# Altium project dji_3s_battery.PrjPcb
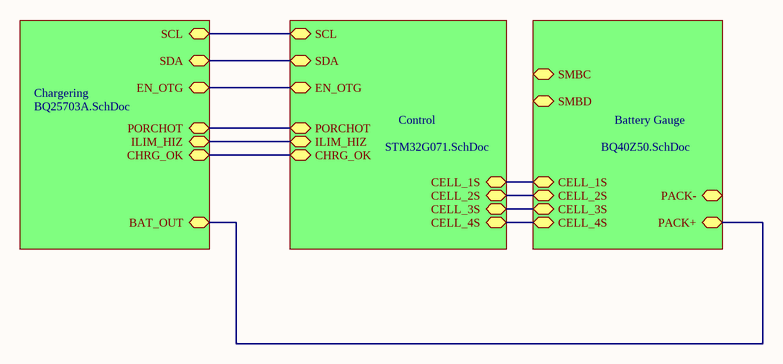
[diagram p0: Smart_Battery_main.SchDoc]
4 sheets, 147 parts. Net scope: global (net labels, ports and power ports of the same name join across sheets).
Board file: dji_3s_battery_PCB.PcbDoc
Sheets:
  Smart_Battery_main.SchDoc
    Battery Gauge = BQ40Z50.SchDoc
    Chargering = BQ25703A.SchDoc
    Control = STM32G071.SchDoc

## Sheet Smart_Battery_main.SchDoc: Smart_Battery
size A4; Author: Dj140; DrawnBy: Dj140

### Sub-sheets
Battery Gauge = BQ40Z50.SchDoc: PACK+, CELL_4S, CELL_3S, CELL_2S, CELL_1S, PACK-, SMBC, SMBD
Chargering = BQ25703A.SchDoc: SCL, SDA, EN_OTG, ILIM_HIZ, BAT_OUT, CHRG_OK, PORCHOT
Control = STM32G071.SchDoc: SCL, SDA, EN_OTG, ILIM_HIZ, PORCHOT, CHRG_OK, CELL_1S, CELL_2S, CELL_3S, CELL_4S

### Nets
(unnamed): sheet Battery Gauge/PACK+, sheet Chargering/BAT_OUT
(unnamed): sheet Battery Gauge/CELL_4S, sheet Control/CELL_4S
(unnamed): sheet Battery Gauge/CELL_3S, sheet Control/CELL_3S
(unnamed): sheet Battery Gauge/CELL_2S, sheet Control/CELL_2S
(unnamed): sheet Battery Gauge/CELL_1S, sheet Control/CELL_1S
(unnamed): sheet Chargering/SCL, sheet Control/SCL
(unnamed): sheet Chargering/SDA, sheet Control/SDA
(unnamed): sheet Chargering/EN_OTG, sheet Control/EN_OTG
(unnamed): sheet Chargering/ILIM_HIZ, sheet Control/ILIM_HIZ
(unnamed): sheet Chargering/CHRG_OK, sheet Control/CHRG_OK
(unnamed): sheet Chargering/PORCHOT, sheet Control/PORCHOT

## Sheet BQ40Z50.SchDoc
size A2
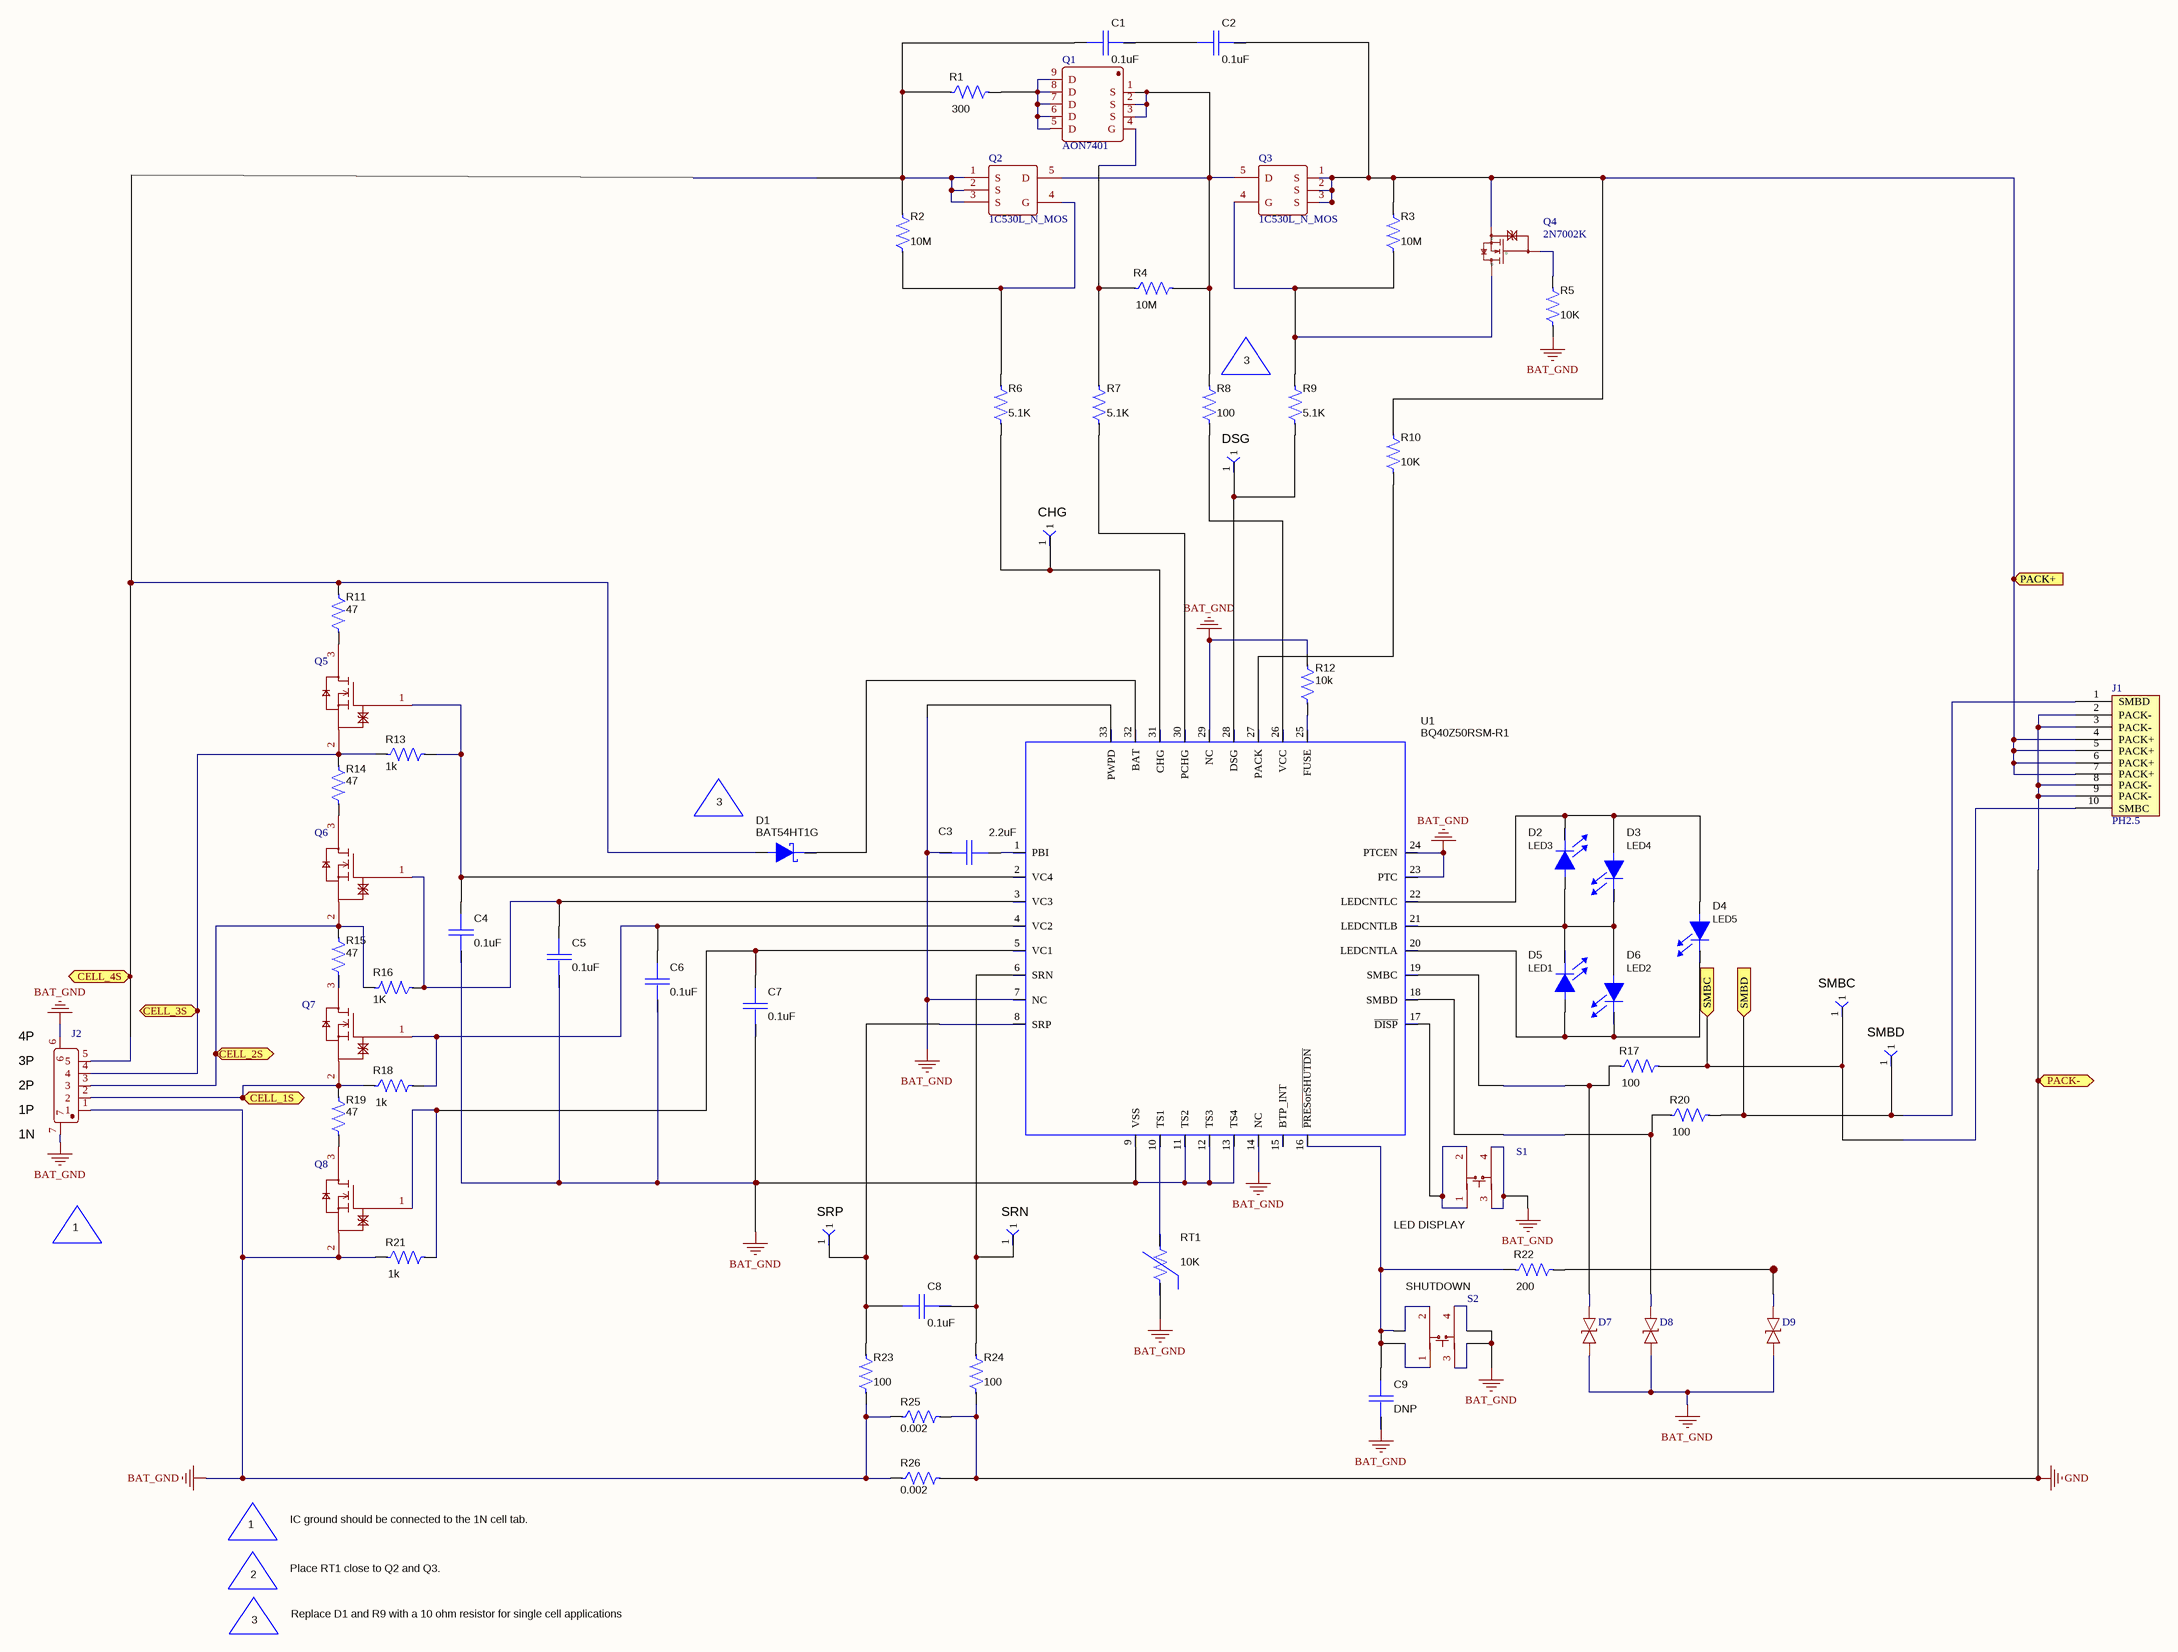
[diagram p1: BQ40Z50.SchDoc]

### Parts
C1  value 0.1uF  [C603]  (hidden comment: C0603C104M5RACTU)
C2  value 0.1uF  [C603]  (hidden comment: C0603C104M5RACTU)
C3  value 2.2uF  [C0805]  (hidden comment: C2012X7R1E225M085AB)
C4  value 0.1uF  [C603]  (hidden comment: C0603C104M5RACTU)
C5  value 0.1uF  [C603]  (hidden comment: C0603C104M5RACTU)
C6  value 0.1uF  [C603]  (hidden comment: C0603C104M5RACTU)
C7  value 0.1uF  [C603]  (hidden comment: C0603C104M5RACTU)
C8  value 0.1uF  [C603]  (hidden comment: C0603C104M5RACTU)
C9  value DNP  [C603]  (hidden comment: C0603C104M5RACTU)
D1  value BAT54HT1G  [SOD-323]  (hidden comment: D-BAT54HT1)
D2  D_LED_SML-LXR1206USBC-TR  [LED0805]  (value not drawn)
D3  D_LED_SML-LXR1206USBC-TR  [LED0805]  (value not drawn)
D4  D_LED_SML-LXR1206USBC-TR  [LED0805]  (value not drawn)
D5  D_LED_SML-LXR1206USBC-TR  [LED0805]  (value not drawn)
D6  D_LED_SML-LXR1206USBC-TR  [LED0805]  (value not drawn)
D7  ESD_Diode  [ESD_Diode]  (value not drawn)
D8  ESD_Diode  [ESD_Diode]  (value not drawn)
D9  ESD_Diode  [ESD_Diode]  (value not drawn)
J1  PH2.5  [PH2.5]
J2  SMD_1.25  [SMD_1.25]  (value not drawn)
Q1  AON7401  [DFN-8]
Q2  1C530L_N_MOS  [LFPAK]
Q3  1C530L_N_MOS  [LFPAK]
Q4  2N7002K  [2N7002K]
Q5  DMN601K  [SOT-23 - duplicate]  (value not drawn)
Q6  DMN601K  [SOT-23 - duplicate]  (value not drawn)
Q7  DMN601K  [SOT-23 - duplicate]  (value not drawn)
Q8  DMN601K  [SOT-23 - duplicate]  (value not drawn)
R1  value 300  [R2512]  (hidden comment: CRCW2512300RJNEG)
R2  value 10M  [0603]  (hidden comment: CRCW060310M0JNEA)
R3  value 10M  [0603]  (hidden comment: CRCW060310M0JNEA)
R4  value 10M  [0603]  (hidden comment: CRCW060310M0JNEA)
R5  value 10K  [0603]  (hidden comment: CRCW060310M0JNEA)
R6  value 5.1K  [0603]  (hidden comment: CRCW06035K10JNEA)
R7  value 5.1K  [0603]  (hidden comment: CRCW06035K10JNEA)
R8  value 100  [0603]  (hidden comment: CRCW0603100RJNEAHP)
R9  value 5.1K  [0603]  (hidden comment: CRCW06035K10JNEA)
R10  value 10K  [0603]  (hidden comment: CRCW060310K0JNEA)
R11  value 47  [R1206]  (hidden comment: CSR1206-0R001F1)
R12  value 10k  [0603]  (hidden comment: CRCW06035K10JNEA)
R13  value 1k  [0603]  (hidden comment: CRCW0603100RJNEAHP)
R14  value 47  [R1206]  (hidden comment: CSR1206-0R001F1)
R15  value 47  [R1206]  (hidden comment: CSR1206-0R001F1)
R16  value 1K  [0603]  (hidden comment: CRCW0603100RJNEAHP)
R17  value 100  [0603]  (hidden comment: CRCW0603100RJNEAHP)
R18  value 1k  [0603]  (hidden comment: CRCW0603100RJNEAHP)
R19  value 47  [R1206]  (hidden comment: CSR1206-0R001F1)
R20  value 100  [0603]  (hidden comment: CRCW0603100RJNEAHP)
R21  value 1k  [0603]  (hidden comment: CRCW0603100RJNEAHP)
R22  value 200  [0603]  (hidden comment: CRCW0603200RJNEA)
R23  value 100  [0603]  (hidden comment: CRCW0603100RJNEAHP)
R24  value 100  [0603]  (hidden comment: CRCW0603100RJNEAHP)
R25  value 0.002  [R2512]  (hidden comment: CRCW2512300RJNEG)
R26  value 0.002  [R2512]  (hidden comment: CRCW2512300RJNEG)
RT1  value 10K  [C0805]  (hidden comment: 103AT-2)
S1  SW_SMD  [SW_SMD]  (value not drawn)
S2  SW_SMD  [SW_SMD]  (value not drawn)
TP1  TP_.040_SMT  [TP_.040_SMT]  (value not drawn)  (no BOM)
TP2  TP_.040_SMT  [TP_.040_SMT]  (value not drawn)  (no BOM)
TP3  TP_.040_SMT  [TP_.040_SMT]  (value not drawn)  (no BOM)
TP4  TP_.040_SMT  [TP_.040_SMT]  (value not drawn)  (no BOM)
TP5  TP_40_SMT  [TP_40_SMT]  (value not drawn)  (no BOM)
TP6  TP_.040_SMT  [TP_.040_SMT]  (value not drawn)  (no BOM)
U1  value BQ40Z50RSM-R1  [QFP-32P_(RSM)]  (hidden comment: BQ40Z55RSM)

### Ports
CELL_1S, CELL_2S, CELL_3S, CELL_4S, PACK+, PACK-, SMBC, SMBD

### Nets
BAT_GND: C3.1 C4.1 C5.1 C6.1 C7.1 C9.1 D7.1 D8.1 D9.1 J2.1 J2.6 J2.7 Q8.2(S) R5.1 R12.2 R21.1 R23.1 R25.1 R26.1 RT1.1 S1.3 S1.4 S2.3 S2.4 U1.7(NC) U1.9(VSS) U1.11(TS2) U1.12(TS3) U1.13(TS4) U1.14(NC) U1.23(PTC) U1.24(PTCEN) U1.29(NC) U1.33(PWPD)
GND: J1.2(PACK-) J1.3(PACK-) J1.8(PACK-) J1.9(PACK-) R24.1 R25.2 R26.2 ; port PACK-
NetC1_1: C1.1 C2.2
NetC1_2: C1.2 D1.2(A) J2.5 Q2.1(S) Q2.2(S) Q2.3(S) R1.1 R2.2 R11.1 ; port CELL_4S
NetC2_1: C2.1 J1.4(PACK+) J1.5(PACK+) J1.6(PACK+) J1.7(PACK+) Q3.1(S) Q3.2(S) Q3.3(S) Q4.2(S) R3.2 R10.2 ; port PACK+
NetC3_2: C3.2 U1.1(PBI)
NetC4_2: C4.2 Q5.1(G) R13.2 U1.2(VC4)
NetC5_2: C5.2 Q6.1(G) R16.1 U1.3(VC3)
NetC6_2: C6.2 Q7.1(G) R18.2 U1.4(VC2)
NetC7_2: C7.2 Q8.1(G) R21.2 U1.5(VC1)
NetC8_1: C8.1 R24.2 TP6.1 U1.6(SRN)
NetC8_2: C8.2 R23.2 TP5.1 U1.8(SRP)
NetC9_2: C9.2 R22.1 S2.1 S2.2 U1.16(~{PRESorSHUTDN})
NetD1_1: D1.1(C) U1.32(BAT)
NetD2_1: D2.1(C) D3.2(A) D4.2(A) U1.22(LEDCNTLC)
NetD2_2: D2.2(A) D3.1(C) D5.1(C) D6.2(A) U1.21(LEDCNTLB)
NetD4_1: D4.1(C) D5.2(A) D6.1(C) U1.20(LEDCNTLA)
NetD7_2: D7.2 R17.1 U1.19(SMBC)
NetD8_2: D8.2 R20.1 U1.18(SMBD)
NetD9_2: D9.2 R22.2
NetJ1_1: J1.1(SMBD) R20.2 TP4.1 ; port SMBD
NetJ1_10: J1.10(SMBC) R17.2 TP3.1 ; port SMBC
NetJ2_2: J2.2 Q7.2(S) R18.1 R19.2 ; port CELL_1S
NetJ2_3: J2.3 Q6.2(S) R15.2 R16.2 ; port CELL_2S
NetJ2_4: J2.4 Q5.2(S) R13.1 R14.1 ; port CELL_3S
NetQ1_1: Q1.1(S) Q1.2(S) Q1.3(S) Q2.5(D) Q3.5(D) R4.2 R8.2
NetQ1_4: Q1.4(G) R4.1 R7.2
NetQ1_5: Q1.5(D) Q1.6(D) Q1.7(D) Q1.8(D) Q1.9(D) R1.2
NetQ2_4: Q2.4(G) R2.1 R6.2
NetQ3_4: Q3.4(G) Q4.3(D) R3.1 R9.2
NetQ4_1: Q4.1(G) R5.2
NetQ5_3: Q5.3(D) R11.2
NetQ6_3: Q6.3(D) R14.2
NetQ7_3: Q7.3(D) R15.1
NetQ8_3: Q8.3(D) R19.1
NetR6_1: R6.1 TP2.1 U1.31(CHG)
NetR7_1: R7.1 U1.30(PCHG)
NetR8_1: R8.1 U1.26(VCC)
NetR9_1: R9.1 TP1.1 U1.28(DSG)
NetR10_1: R10.1 U1.27(PACK)
NetR12_1: R12.1 U1.25(FUSE)
NetRT1_2: RT1.2 U1.10(TS1)
NetS1_1: S1.1 S1.2 U1.17(~{DISP})

Not connected (* = marked no-connect by the designer): U1 15(BTP_INT)

### Notes on the sheet
- 3
- DSG
- (near TP2) CHG
- (near D2) LED3
- (near D3) LED4
- (near D4) LED5
- (near D5) LED1
- (near D6) LED2
- (near TP3) SMBC
- (near J2) 4P
- (near J2) 3P
- (near TP4) SMBD
- (near J2) 2P
- (near J2) 1P
- (near J2) 1N
- 1
- (near TP5) SRP
- (near TP6) SRN
- (near S1) LED DISPLAY
- (near S2) SHUTDOWN
- IC ground should be connected to the 1N cell tab.
- 2
- Place RT1 close to Q2 and Q3.
- Replace D1 and R9 with a 10 ohm resistor for single cell applications

### Library data of the parts
C1 C2 C4-C9 = C0603: Capacitor, Ceramic Chip, 50V, X7R, ±20%; Manufacturer: Kemet; Area: 5650; ComponentHeight: 0.035 inch; SymbolVersion: 07/31/2009 12:17:27; PartNumber: C0603C104M5RACTU; PackageReference: 603; ComponentLink1Description: AEO Datasheet Link
C3 = C0805: Capacitor, Ceramic Chip, 25V, X7R ±20%; Manufacturer: TDK; Area: 10560; ComponentHeight: 0.053 inch; SymbolVersion: 06/23/2010 08:22:44; PartNumber: C2012X7R1E225M085AB; PackageReference: 805; ComponentLink1Description: AEO Datasheet Link
D1 = D-BAT54HT1: Diode, Schottky, 200-mA, 30-V; Manufacturer: On Semi; Area: 14105; ComponentHeight: 0.043 inch; ComponentLink1URL: \\vette02\pmp_pcb\pcad_pdf's\BAT54HT1-D.pdf; SymbolVersion: 02/28/2007 14:26:03; PackageReference: SOD323; PartNumber: BAT54HT1G; ComponentLink1Description: AEO Datasheet Link
D2-D6 = D_LED_SML-LXR1206USBC-TR: Diode, LED, 2X3mm 565nm GRN WTR CLR SMD; PartNumber: SML-LX23GC; Manufacturer: Lumex; Area: 22000; Value: SML-LX23GC; ComponentLink1URL: \\vette02\pmp_pcb\pcad_pdf's\SML-LXR1206USBC-TR[1].pdf; SymbolVersion: 08/01/2007 15:25:38; PackageReference: 1206; ComponentHeight: 0.041 inch; ComponentLink1Description: AEO Datasheet Link
R1 R25 R26 = R2512_5%: Resistor, Chip 1W, 5%; Manufacturer: Vishay-Dale; Area: 56,000; SymbolVersion: 05/06/2011 14:04:06; PackageReference: 2512; PartNumber: CRCW2512300RJNEG; ComponentLink1Description: AEO Datasheet Link
R2-R10 R12 R13 R16-R18 R20 R21 R23 R24 = R0603_1%: Resistor, Chip, 1/10W, 5%; Manufacturer: Vishay-Dale; Area: 9100; SymbolVersion: 05/06/2011 13:51:33; PackageReference: 603; ComponentLink1Description: AEO Datasheet Link
  R2-R5: PartNumber: CRCW060310M0JNEA
  R6 R7 R9 R12: PartNumber: CRCW06035K10JNEA
  R8 R13 R16-R18 R20 R21 R23 R24: PartNumber: CRCW0603100RJNEAHP
  R10: PartNumber: CRCW060310K0JNEA
R11 R14 R15 R19 = R1206_1%: Resistor, Chip 1 watt, ±1%, 50 ppm; Manufacturer: Reidon; Area: 20,000; SymbolVersion: 05/06/2011 13:59:00; PackageReference: 1206; PartNumber: CSR1206-0R001F1; ComponentLink1Description: AEO Datasheet Link
R22 = R0603_1%: Resistor, Chip, 1/16W, 5%; Manufacturer: Vishay-Dale; Area: 9100; SymbolVersion: 05/06/2011 13:51:33; PackageReference: 603; PartNumber: CRCW0603200RJNEA; ComponentLink1Description: AEO Datasheet Link
RT1 = THERMISTOR-103AT: Thermistor, NTC, 3-A; Manufacturer: Semitec; Area: 25,000; ComponentHeight: 0.335 inch; ComponentLink1URL: \\vette02\pmp_pcb\pcad_pdf's\AT_Thermistor.pdf; PackageReference: 0.095 X 0.150 inch; SymbolVersion: 07/31/2009 12:17:31; PartNumber: 103AT-2; ComponentLink1Description: AEO Datasheet Link
TP1-TP4 TP6 = TP_.040_SMT: Test point, 40 mil SMT; Value: None; ComponentHeight: None; area: *; SymbolVersion: 11/01/2006 14:05:31; PackageReference: None; Manufacturer: None; PartNumber: None; ComponentLink1Description: AEO Datasheet Link
TP5 = TP_40_SMT: Test point, 40 mil SMT; Manufacturer: None; Value: None; ComponentHeight: None; SymbolVersion: 07/13/2010 09:50:06; area: *; PackageReference: None; PartNumber: None; ComponentLink1Description: AEO Datasheet Link
U1 = BQ40Z55RSM: IC, 2 to 4-Series Li-Ion Battery Pack Manager; Manufacturer: TI; Alternate Manufacturer: None; Area: 51072; ComponentHeight: 0.04mil; ComponentLink1URL: \\vette02\pmp_pcb\pcad_pdf's\bq40z55_DS.pdf; SymbolVersion: 06/22/2012 10:16:53; PackageReference: QFN; PartNumber: BQ40Z50RSM-R1; ComponentLink1Description: AEO Datasheet Link

## Sheet BQ25703A.SchDoc
size A2
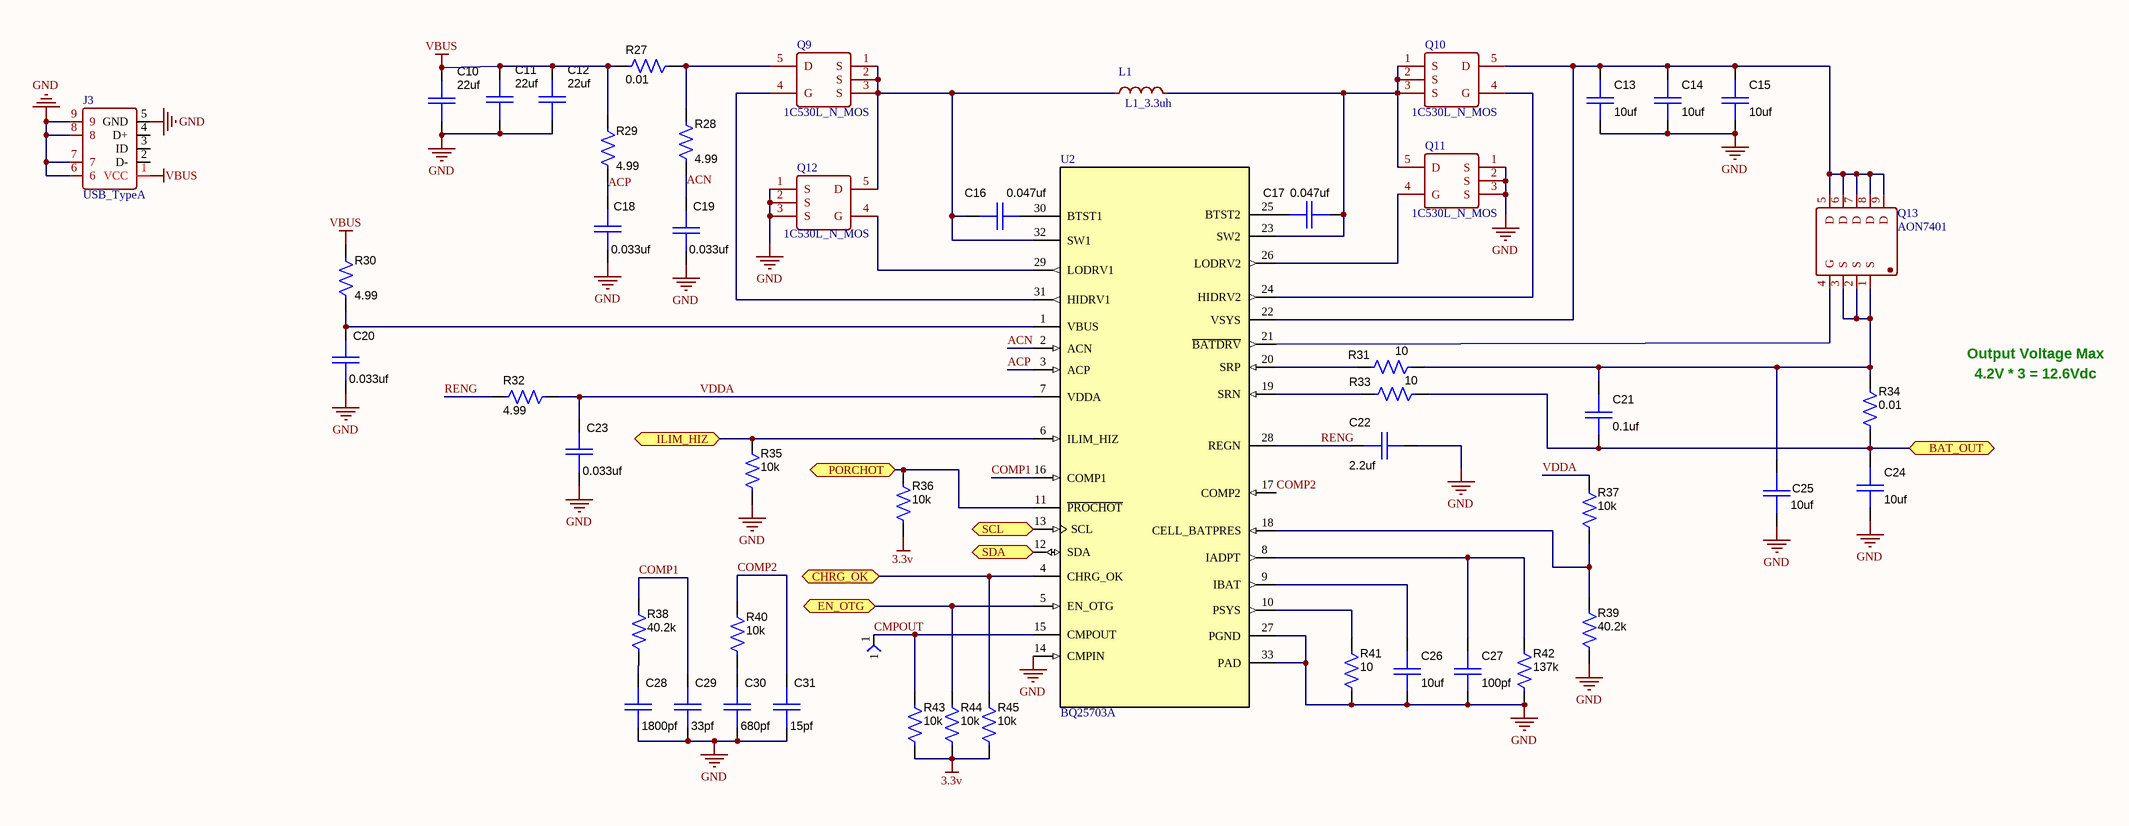
[diagram p2: BQ25703A.SchDoc]

### Parts
C10  value 22uf  [C603]  (hidden comment: C0603C104M5RACTU)
C11  value 22uf  [C603]  (hidden comment: C0603C104M5RACTU)
C12  value 22uf  [C603]  (hidden comment: C0603C104M5RACTU)
C13  value 10uf  [C603]  (hidden comment: C0603C104M5RACTU)
C14  value 10uf  [C603]  (hidden comment: C0603C104M5RACTU)
C15  value 10uf  [C603]  (hidden comment: C0603C104M5RACTU)
C16  value 0.047uf  [C603]  (hidden comment: C0603C104M5RACTU)
C17  value 0.047uf  [C603]  (hidden comment: C0603C104M5RACTU)
C18  value 0.033uf  [C603]  (hidden comment: C0603C104M5RACTU)
C19  value 0.033uf  [C603]  (hidden comment: C0603C104M5RACTU)
C20  value 0.033uf  [C603]  (hidden comment: C0603C104M5RACTU)
C21  value 0.1uf  [C603]  (hidden comment: C0603C104M5RACTU)
C22  value 2.2uf  [C603]  (hidden comment: C0603C104M5RACTU)
C23  value 0.033uf  [C603]  (hidden comment: C0603C104M5RACTU)
C24  value 10uf  [C603]  (hidden comment: C0603C104M5RACTU)
C25  value 10uf  [C603]  (hidden comment: C0603C104M5RACTU)
C26  value 10uf  [C603]  (hidden comment: C0603C104M5RACTU)
C27  value 100pf  [C603]  (hidden comment: C0603C104M5RACTU)
C28  value 1800pf  [C603]  (hidden comment: C0603C104M5RACTU)
C29  value 33pf  [C603]  (hidden comment: C0603C104M5RACTU)
C30  value 680pf  [C603]  (hidden comment: C0603C104M5RACTU)
C31  value 15pf  [C603]  (hidden comment: C0603C104M5RACTU)
J3  USB_TypeA  [USB_TypeA]
L1  L1_3.3uh  [3.3uh]
Q9  1C530L_N_MOS  [LFPAK]
Q10  1C530L_N_MOS  [LFPAK]
Q11  1C530L_N_MOS  [LFPAK]
Q12  1C530L_N_MOS  [LFPAK]
Q13  AON7401  [DFN-8]
R27  value 0.01  [0603]  (hidden comment: CRCW0603100RJNEAHP)
R28  value 4.99  [0603]  (hidden comment: CRCW0603100RJNEAHP)
R29  value 4.99  [0603]  (hidden comment: CRCW0603100RJNEAHP)
R30  value 4.99  [0603]  (hidden comment: CRCW0603100RJNEAHP)
R31  value 10  [0603]  (hidden comment: CRCW0603100RJNEAHP)
R32  value 4.99  [0603]  (hidden comment: CRCW0603100RJNEAHP)
R33  value 10  [0603]  (hidden comment: CRCW0603100RJNEAHP)
R34  value 0.01  [0603]  (hidden comment: CRCW0603100RJNEAHP)
R35  value 10k  [0603]  (hidden comment: CRCW0603100RJNEAHP)
R36  value 10k  [0603]  (hidden comment: CRCW0603100RJNEAHP)
R37  value 10k  [0603]  (hidden comment: CRCW0603100RJNEAHP)
R38  value 40.2k  [0603]  (hidden comment: CRCW0603100RJNEAHP)
R39  value 40.2k  [0603]  (hidden comment: CRCW0603100RJNEAHP)
R40  value 10k  [0603]  (hidden comment: CRCW0603100RJNEAHP)
R41  value 10  [0603]  (hidden comment: CRCW0603100RJNEAHP)
R42  value 137k  [0603]  (hidden comment: CRCW0603100RJNEAHP)
R43  value 10k  [0603]  (hidden comment: CRCW0603100RJNEAHP)
R44  value 10k  [0603]  (hidden comment: CRCW0603100RJNEAHP)
R45  value 10k  [0603]  (hidden comment: CRCW0603100RJNEAHP)
TP7  TP_40_SMT  [TP_40_SMT]  (value not drawn)  (no BOM)
U2  BQ25703A  [BQ25703A]

### Ports
BAT_OUT, CHRG_OK, EN_OTG, ILIM_HIZ, PORCHOT, SCL, SDA

### Nets
3.3v: R36.2 R43.2 R44.2 R45.2
GND: C10.2 C11.2 C12.2 C13.1 C14.1 C15.1 C18.2 C19.2 C20.2 C22.1 C23.2 C24.1 C25.1 C26.1 C27.1 C28.2 C29.2 C30.2 C31.2 J3.5(GND) J3.6 J3.7 J3.8 J3.9 Q11.1(S) Q11.2(S) Q11.3(S) Q12.1(S) Q12.2(S) Q12.3(S) R35.2 R39.2 R41.2 R42.2 U2.14(CMPIN) U2.27(PGND) U2.33(PAD)
VBUS: C10.1 C11.1 C12.1 J3.1(VCC) R27.2 R29.1 R30.2
ACN: C19.1 R28.1 U2.2(ACN)
ACP: C18.1 R29.2 U2.3(ACP)
CMPOUT: R43.1 TP7.1 U2.15(CMPOUT)
COMP1: C29.1 R38.1 U2.16(COMP1)
COMP2: C31.1 R40.1 U2.17(COMP2)
RENG: C22.2 R32.2 U2.28(REGN)
VDDA: C23.1 R32.1 R37.1 U2.7(VDDA)
NetC13_2: C13.2 C14.2 C15.2 Q10.5(D) Q13.5(D) Q13.6(D) Q13.7(D) Q13.8(D) Q13.9(D) U2.22(VSYS)
NetC16_1: C16.1 U2.30(BTST1)
NetC16_2: C16.2 L1.1 Q9.1(S) Q9.2(S) Q9.3(S) Q12.5(D) U2.32(SW1)
NetC17_1: C17.1 U2.25(BTST2)
NetC17_2: C17.2 L1.2 Q10.1(S) Q10.2(S) Q10.3(S) Q11.5(D) U2.23(SW2)
NetC20_1: C20.1 R30.1 U2.1(VBUS)
NetC21_1: C21.1 C24.2 R33.1 R34.2 ; port BAT_OUT
NetC21_2: C21.2 C25.2 Q13.1(S) Q13.2(S) Q13.3(S) R31.1 R34.1
NetC26_2: C26.2 U2.9(IBAT)
NetC27_2: C27.2 R42.1 U2.8(IADPT)
NetC28_1: C28.1 R38.2
NetC30_1: C30.1 R40.2
NetQ9_4: Q9.4(G) U2.31(HIDRV1)
NetQ9_5: Q9.5(D) R27.1 R28.2
NetQ10_4: Q10.4(G) U2.24(HIDRV2)
NetQ11_4: Q11.4(G) U2.26(LODRV2)
NetQ12_4: Q12.4(G) U2.29(LODRV1)
NetQ13_4: Q13.4(G) U2.21(~{BATDRV})
NetR31_2: R31.2 U2.20(SRP)
NetR33_2: R33.2 U2.19(SRN)
NetR35_1: R35.1 U2.6(ILIM_HIZ) ; port ILIM_HIZ
NetR36_1: R36.1 U2.11(~{PROCHOT}) ; port PORCHOT
NetR37_2: R37.2 R39.1 U2.18(CELL_BATPRES)
NetR41_1: R41.1 U2.10(PSYS)
NetR44_1: R44.1 U2.5(EN_OTG) ; port EN_OTG
NetR45_1: R45.1 U2.4(CHRG_OK) ; port CHRG_OK
NetU2_12: U2.12(SDA) ; port SDA
NetU2_13: U2.13(SCL) ; port SCL

Not connected (* = marked no-connect by the designer): J3 2(D-) 3(ID) 4(D+)

### Notes on the sheet
- 4.2V * 3 = 12.6Vdc
- Output Voltage Max

### Library data of the parts
C10-C31 = C0603: as C1 on sheet BQ40Z50; ComponentHeight: 0.035 inch; SymbolVersion: 07/31/2009 12:17:27; PartNumber: C0603C104M5RACTU; PackageReference: 603; ComponentLink1Description: AEO Datasheet Link
R27-R45 = R0603_1%: as R2 on sheet BQ40Z50; SymbolVersion: 05/06/2011 13:51:33; PackageReference: 603; PartNumber: CRCW0603100RJNEAHP; ComponentLink1Description: AEO Datasheet Link
TP7 = TP_40_SMT: as TP5 on sheet BQ40Z50; ComponentHeight: None; SymbolVersion: 07/13/2010 09:50:06; area: *; PackageReference: None; PartNumber: None; ComponentLink1Description: AEO Datasheet Link

## Sheet STM32G071.SchDoc
size A3
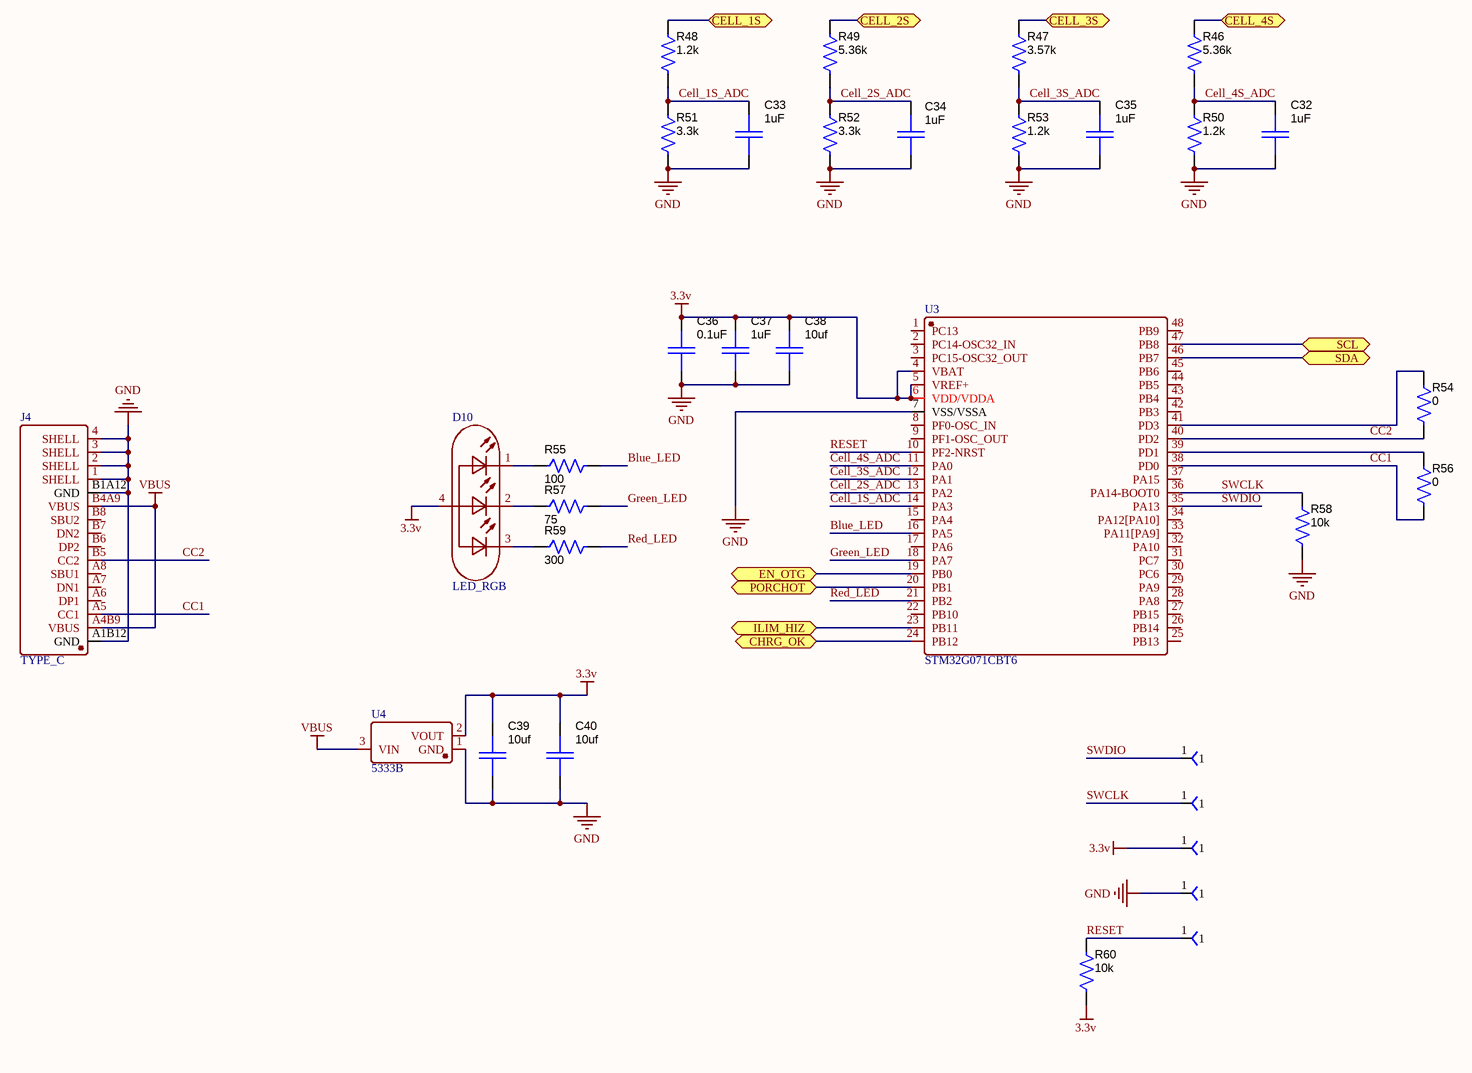
[diagram p3: STM32G071.SchDoc]

### Parts
C32  value 1uF  [C603]  (hidden comment: C0603C104M5RACTU)
C33  value 1uF  [C603]  (hidden comment: C0603C104M5RACTU)
C34  value 1uF  [C603]  (hidden comment: C0603C104M5RACTU)
C35  value 1uF  [C603]  (hidden comment: C0603C104M5RACTU)
C36  value 0.1uF  [C603]  (hidden comment: C0603C104M5RACTU)
C37  value 1uF  [C603]  (hidden comment: C0603C104M5RACTU)
C38  value 10uf  [C603]  (hidden comment: C0603C104M5RACTU)
C39  value 10uf  [C603]  (hidden comment: C0603C104M5RACTU)
C40  value 10uf  [C603]  (hidden comment: C0603C104M5RACTU)
D10  LED_RGB  [LED_RGB]
J4  TYPE_C  [TYPE_C]
R46  value 5.36k  [0603]  (hidden comment: CRCW0603100RJNEAHP)
R47  value 3.57k  [0603]  (hidden comment: CRCW0603100RJNEAHP)
R48  value 1.2k  [0603]  (hidden comment: CRCW0603100RJNEAHP)
R49  value 5.36k  [0603]  (hidden comment: CRCW0603100RJNEAHP)
R50  value 1.2k  [0603]  (hidden comment: CRCW0603100RJNEAHP)
R51  value 3.3k  [0603]  (hidden comment: CRCW0603100RJNEAHP)
R52  value 3.3k  [0603]  (hidden comment: CRCW0603100RJNEAHP)
R53  value 1.2k  [0603]  (hidden comment: CRCW0603100RJNEAHP)
R54  value 0  [0603]  (hidden comment: CRCW0603100RJNEAHP)
R55  value 100  [0603]  (hidden comment: CRCW0603100RJNEAHP)
R56  value 0  [0603]  (hidden comment: CRCW0603100RJNEAHP)
R57  value 75  [0603]  (hidden comment: CRCW0603100RJNEAHP)
R58  value 10k  [0603]  (hidden comment: CRCW0603100RJNEAHP)
R59  value 300  [0603]  (hidden comment: CRCW0603100RJNEAHP)
R60  value 10k  [0603]  (hidden comment: CRCW0603100RJNEAHP)
TP8  TP_40_SMT  [TP_40_SMT]  (value not drawn)  (no BOM)
TP9  TP_40_SMT  [TP_40_SMT]  (value not drawn)  (no BOM)
TP10  TP_40_SMT  [TP_40_SMT]  (value not drawn)  (no BOM)
TP11  TP_40_SMT  [TP_40_SMT]  (value not drawn)  (no BOM)
TP12  TP_40_SMT  [TP_40_SMT]  (value not drawn)  (no BOM)
U3  STM32G071CBT6  [STM32G071CBT6]
U4  5333B  [SOT-23 - duplicate]

### Ports
CELL_1S, CELL_2S, CELL_3S, CELL_4S, CHRG_OK, EN_OTG, ILIM_HIZ, PORCHOT, SCL, SDA

### Nets
3.3v: C36.1 C37.1 C38.1 C39.1 C40.1 D10.4(+) R60.1 TP10.1 U3.4(VBAT) U3.5(VREF+) U3.6(VDD/VDDA) U4.2(VOUT)
GND: C32.2 C33.2 C34.2 C35.2 C36.2 C37.2 C38.2 C39.2 C40.2 J4.1(SHELL) J4.2(SHELL) J4.3(SHELL) J4.4(SHELL) J4.A1B12(GND) J4.B1A12(GND) R50.2 R51.2 R52.2 R53.2 R58.1 TP11.1 U3.7(VSS/VSSA) U4.1(GND)
VBUS: J4.A4B9(VBUS) J4.B4A9(VBUS) U4.3(VIN)
Blue_LED: R55.2 U3.16(PA5)
CC1: J4.A5(CC1) R56.2 U3.38(PD0)
CC2: J4.B5(CC2) R54.2 U3.40(PD2)
Cell_1S_ADC: C33.1 R48.2 R51.1 U3.14(PA3)
Cell_2S_ADC: C34.1 R49.2 R52.1 U3.13(PA2)
Cell_3S_ADC: C35.1 R47.2 R53.1 U3.12(PA1)
Cell_4S_ADC: C32.1 R46.2 R50.1 U3.11(PA0)
Green_LED: R57.2 U3.18(PA7)
Red_LED: R59.2 U3.21(PB2)
RESET: R60.2 TP12.1 U3.10(PF2-NRST)
SWCLK: R58.2 TP9.1 U3.36(PA14-BOOT0)
SWDIO: TP8.1 U3.35(PA13)
NetC1_2: R46.1 ; port CELL_4S
NetD10_1: D10.1(R-) R55.1
NetD10_2: D10.2(G-) R57.1
NetD10_3: D10.3(B-) R59.1
NetJ2_2: R48.1 ; port CELL_1S
NetJ2_3: R49.1 ; port CELL_2S
NetJ2_4: R47.1 ; port CELL_3S
NetR35_1: U3.23(PB11) ; port ILIM_HIZ
NetR36_1: U3.20(PB1) ; port PORCHOT
NetR44_1: U3.19(PB0) ; port EN_OTG
NetR45_1: U3.24(PB12) ; port CHRG_OK
NetR54_1: R54.1 U3.41(PD3)
NetR56_1: R56.1 U3.39(PD1)
NetU2_12: U3.46(PB7) ; port SDA
NetU2_13: U3.47(PB8) ; port SCL

Not connected (* = marked no-connect by the designer): J4 A6(DP1) A7(DN1) A8(SBU1) B6(DP2) B7(DN2) B8(SBU2); U3 1(PC13) 2(PC14-OSC32_IN) 3(PC15-OSC32_OUT) 8(PF0-OSC_IN) 9(PF1-OSC_OUT) 15(PA4) 17(PA6) 22(PB10) 25(PB13) 26(PB14) 27(PB15) 28(PA8) 29(PA9) 30(PC6) 31(PC7) 32(PA10) 33(PA11[PA9]) 34(PA12[PA10]) 37(PA15) 42(PB3) 43(PB4) 44(PB5) 45(PB6) 48(PB9)

### Library data of the parts
C32-C40 = C0603: as C1 on sheet BQ40Z50; ComponentHeight: 0.035 inch; SymbolVersion: 07/31/2009 12:17:27; PartNumber: C0603C104M5RACTU; PackageReference: 603; ComponentLink1Description: AEO Datasheet Link
R46-R60 = R0603_1%: as R2 on sheet BQ40Z50; SymbolVersion: 05/06/2011 13:51:33; PackageReference: 603; PartNumber: CRCW0603100RJNEAHP; ComponentLink1Description: AEO Datasheet Link
TP8-TP12 = TP_40_SMT: as TP5 on sheet BQ40Z50; ComponentHeight: None; SymbolVersion: 07/13/2010 09:50:06; area: *; PackageReference: None; PartNumber: None; ComponentLink1Description: AEO Datasheet Link

## Nets that join several sheets
3.3v: BQ25703A (R36.2 R43.2 R44.2 R45.2), STM32G071 (12 pins)
GND: BQ40Z50 (7 pins), BQ25703A (37 pins), STM32G071 (23 pins)
VBUS: BQ25703A (7 pins), STM32G071 (J4.A4B9 J4.B4A9 U4.3)
NetC1_2: BQ40Z50 (9 pins), STM32G071 (R46.1)
NetJ2_2: BQ40Z50 (J2.2 Q7.2 R18.1 R19.2), STM32G071 (R48.1)
NetJ2_3: BQ40Z50 (J2.3 Q6.2 R15.2 R16.2), STM32G071 (R49.1)
NetJ2_4: BQ40Z50 (J2.4 Q5.2 R13.1 R14.1), STM32G071 (R47.1)
NetR35_1: BQ25703A (R35.1 U2.6), STM32G071 (U3.23)
NetR36_1: BQ25703A (R36.1 U2.11), STM32G071 (U3.20)
NetR44_1: BQ25703A (R44.1 U2.5), STM32G071 (U3.19)
NetR45_1: BQ25703A (R45.1 U2.4), STM32G071 (U3.24)
NetU2_12: BQ25703A (U2.12), STM32G071 (U3.46)
NetU2_13: BQ25703A (U2.13), STM32G071 (U3.47)